# Altium schematic sheet MCBSchematic.SchDoc
size A
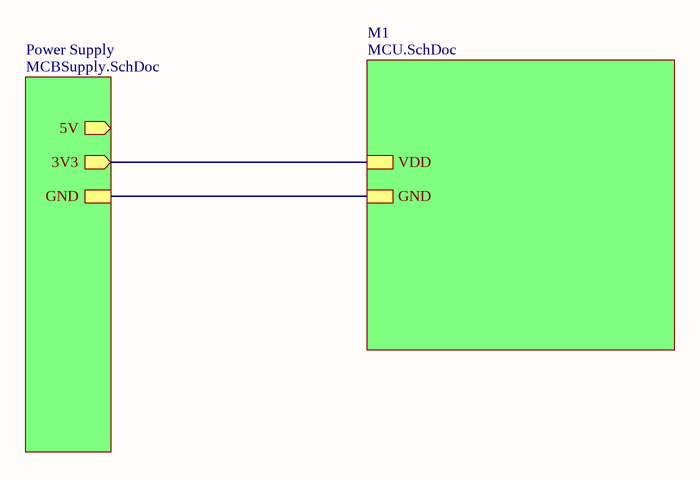
[diagram p0: MCBSchematic.SchDoc]

## Sub-sheets
M1 = MCU.SchDoc: GND, VDD
Power Supply = MCBSupply.SchDoc: 5V (out), 3V3 (out), GND

## Nets
(unnamed): sheet M1/GND, sheet Power Supply/GND
(unnamed): sheet M1/VDD, sheet Power Supply/3V3